# Altium schematic sheet PWR_MGMT.SchDoc
size D; SheetNumber: 2; SheetTotal: 4
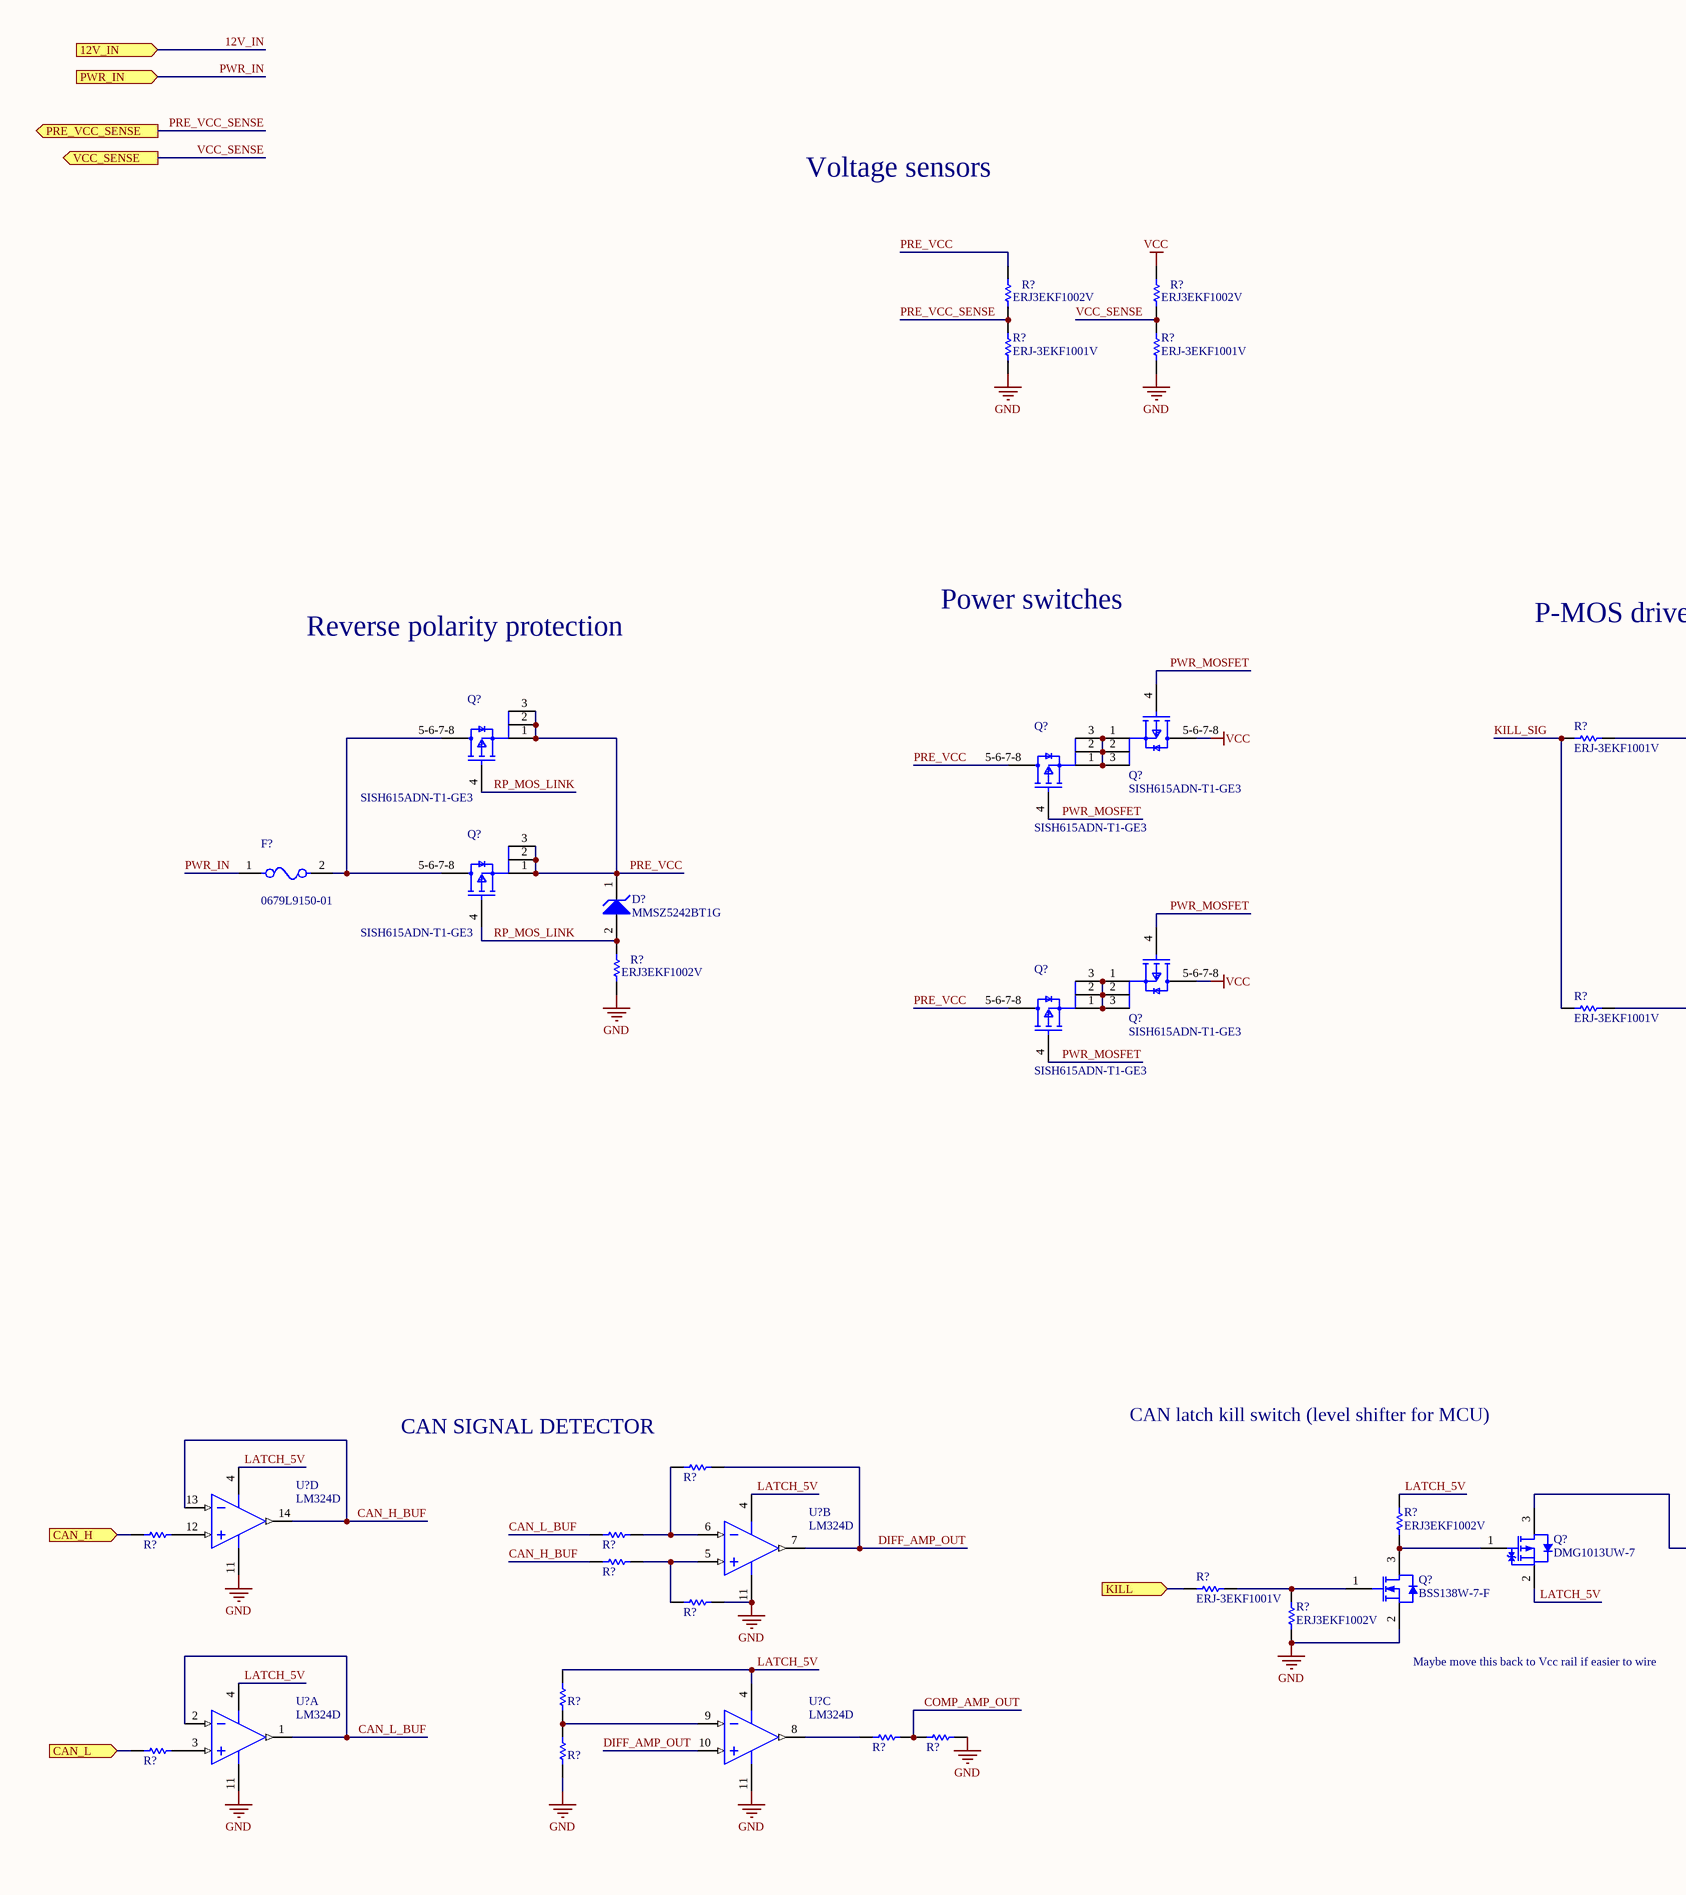
[diagram p0: PWR_MGMT.SchDoc, left]
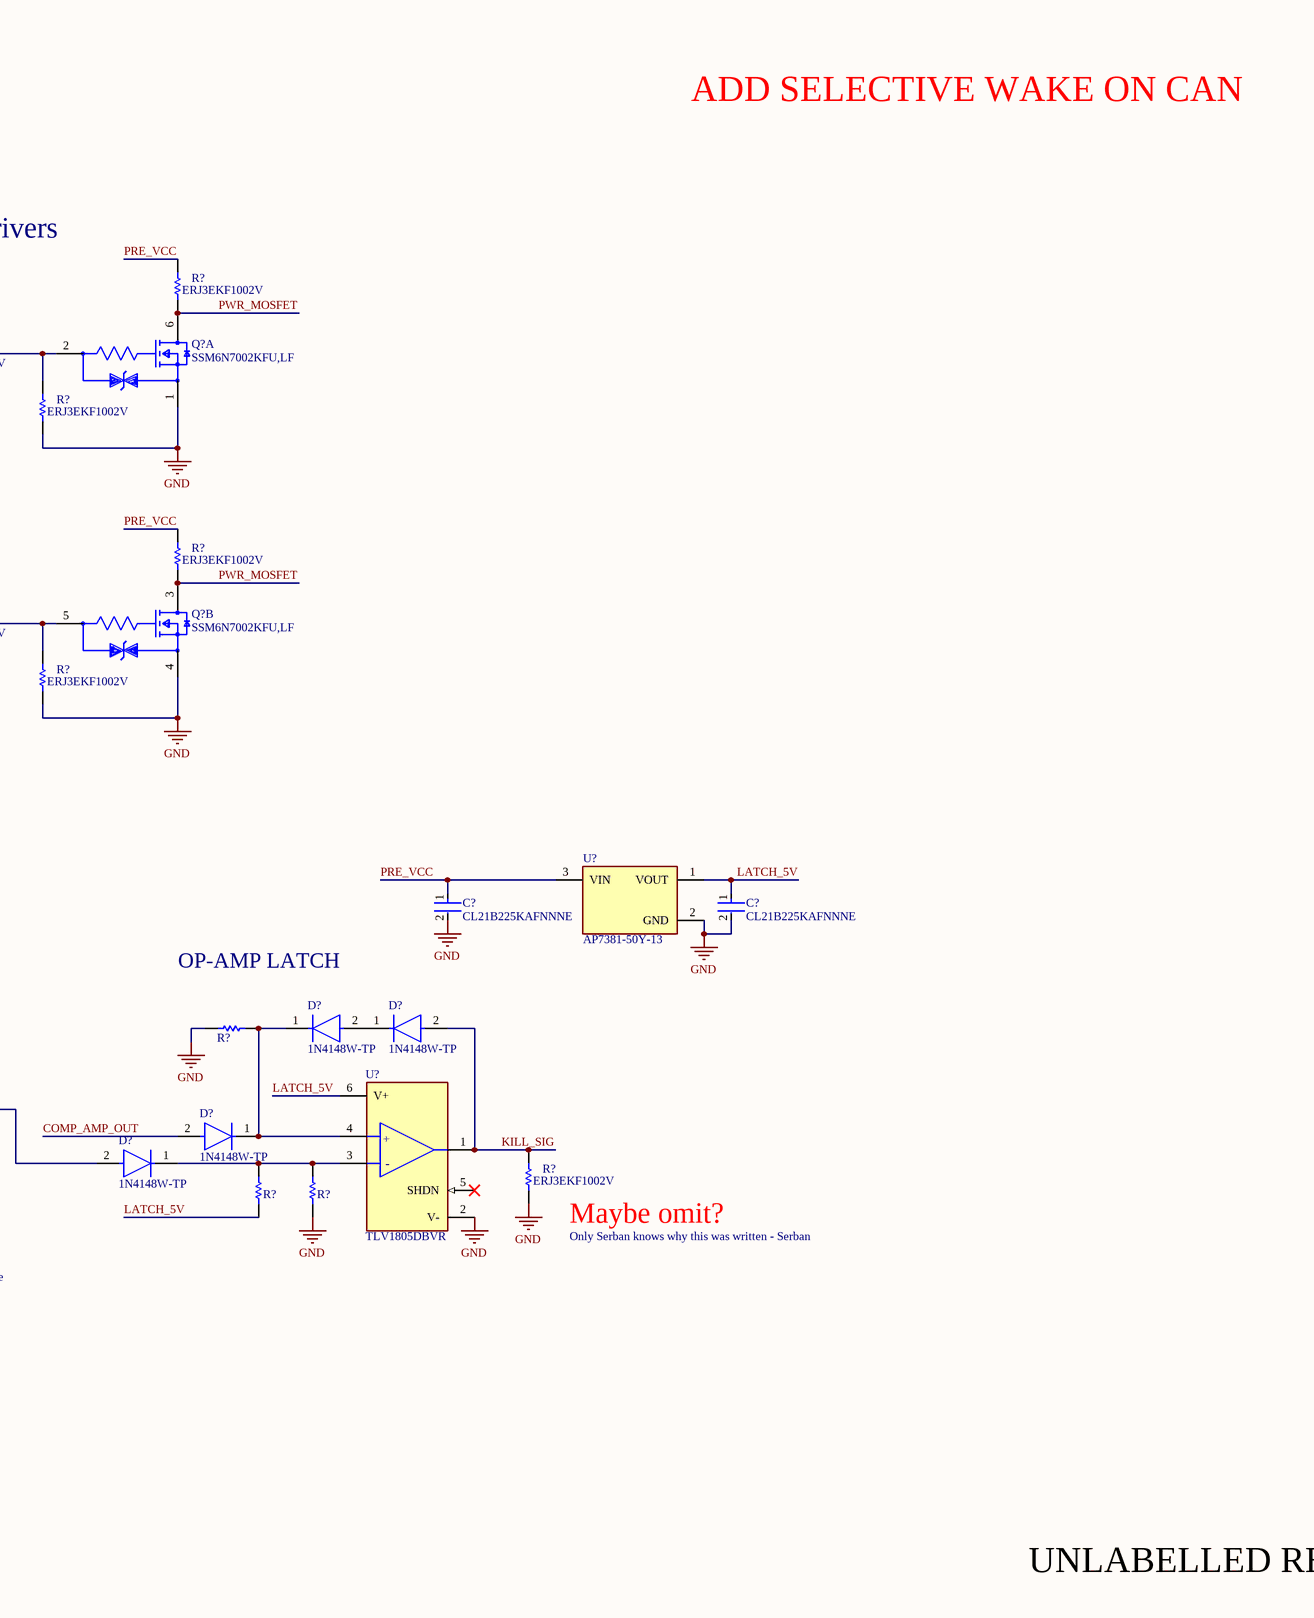
[diagram p1: PWR_MGMT.SchDoc, right]

## Parts
(Parts that share a designator on the sheet are numbered #1, #2 ... from top to bottom, then left to right.)
C?#1  CL21B225KAFNNNE  [FP-0805-L_2_01_0_2-W_1_25-IPC_B]
C?#2  CL21B225KAFNNNE  [FP-0805-L_2_01_0_2-W_1_25-IPC_B]
D?#1  MMSZ5242BT1G  [ONSC-SOD-123-2-425-04_V]
D?#2  1N4148W-TP  [FP-SOD-123-IPC_A]
D?#3  1N4148W-TP  [FP-SOD-123-IPC_A]
D?#4  1N4148W-TP  [FP-SOD-123-IPC_A]
D?#5  1N4148W-TP  [FP-SOD-123-IPC_A]
F?  0679L9150-01  [FP-0679L-MFG]
Q?#1  SISH615ADN-T1-GE3  [SISH615ADN-T1-GE3-Footprint-1]
Q?#2  SSM6N7002KFU,LF  [FP-SSOP6-P-0_65A-MFG]  (part A of 2)
Q?#3  SISH615ADN-T1-GE3  [SISH615ADN-T1-GE3-Footprint-1]
Q?#4  SISH615ADN-T1-GE3  [SISH615ADN-T1-GE3-Footprint-1]
Q?#5  SISH615ADN-T1-GE3  [SISH615ADN-T1-GE3-Footprint-1]
Q?#6  SISH615ADN-T1-GE3  [SISH615ADN-T1-GE3-Footprint-1]
Q?#7  SSM6N7002KFU,LF  [FP-SSOP6-P-0_65A-MFG]  (part B of 2)
Q?#8  SISH615ADN-T1-GE3  [SISH615ADN-T1-GE3-Footprint-1]
Q?#9  DMG1013UW-7  [DIOD-SOT323-3_V]
Q?#10  BSS138W-7-F  [DIOD-SOT323-3_V]
R?#1  ERJ3EKF1002V  [RESC1609X55X30LL15T15]
R?#2  ERJ3EKF1002V  [RESC1609X55X30LL15T15]
R?#3  ERJ-3EKF1001V  [RESC1608X55X30LL15T15]
R?#4  ERJ-3EKF1001V  [RESC1608X55X30LL15T15]
R?#5  ERJ3EKF1002V  [RESC1609X55X30LL15T15]
R?#6  ERJ-3EKF1001V  [RESC1608X55X30LL15T15]
R?#7  ERJ3EKF1002V  [RESC1609X55X30LL15T15]
R?#8  ERJ3EKF1002V  [RESC1609X55X30LL15T15]
R?#9  ERJ3EKF1002V  [RESC1609X55X30LL15T15]
R?#10  ERJ-3EKF1001V  [RESC1608X55X30LL15T15]
R?#11  ERJ3EKF1002V  [RESC1609X55X30LL15T15]
R?#12  ERJ3EKF1002V  [RESC1609X55X30LL15T15]  (value not drawn)
R?#13  ERJ3EKF1002V  [RESC1609X55X30LL15T15]  (value not drawn)
R?#14  ERJ3EKF1002V  [RESC1609X55X30LL15T15]  (value not drawn)
R?#15  ERJ3EKF1002V  [RESC1609X55X30LL15T15]  (value not drawn)
R?#16  ERJ3EKF1002V  [RESC1609X55X30LL15T15]
R?#17  ERJ3EKF1002V  [RESC1609X55X30LL15T15]
R?#18  ERJ3EKF1002V  [RESC1609X55X30LL15T15]  (value not drawn)
R?#19  ERJ3EKF1002V  [RESC1609X55X30LL15T15]  (value not drawn)
R?#20  ERJ3EKF1002V  [RESC1609X55X30LL15T15]  (value not drawn)
R?#21  ERJ3EKF1002V  [RESC1609X55X30LL15T15]  (value not drawn)
R?#22  ERJ-3EKF1001V  [RESC1608X55X30LL15T15]
R?#23  ERJ3EKF1002V  [RESC1609X55X30LL15T15]
R?#24  ERJ3EKF1002V  [RESC1609X55X30LL15T15]  (value not drawn)
R?#25  ERJ3EKF1002V  [RESC1609X55X30LL15T15]  (value not drawn)
R?#26  ERJ3EKF1002V  [RESC1609X55X30LL15T15]  (value not drawn)
R?#27  ERJ3EKF1002V  [RESC1609X55X30LL15T15]  (value not drawn)
R?#28  ERJ-3EKF1001V  [RESC1608X55X30LL15T15]  (value not drawn)
U?#1  AP7381-50Y-13  [FP-SOT89-MFG]
U?#2  TLV1805DBVR  [FP-DBV0006A-IPC_C]
U?#3  LM324D  [D0014A_L]  (part D of 4)
U?#4  LM324D  [D0014A_L]  (part B of 4)
U?#5  LM324D  [D0014A_L]  (part A of 4)
U?#6  LM324D  [D0014A_L]  (part C of 4)

## Ports
12V_IN (in), CAN_H (in), CAN_L (in), KILL (in), PRE_VCC_SENSE (out), PWR_IN (in), VCC_SENSE (out)

## Nets
GND: C?#1.2 C?#2.2 Q?#2.1(Source1) Q?#7.4(Source2) Q?#10.2(S) R?#3.1 R?#4.1 R?#7.2 R?#9.2 R?#11.2 R?#12.2 R?#17.2 R?#20.1 R?#21.2 R?#23.1 R?#26.1 R?#28.1 U?#1.2(GND) U?#2.2(V-) U?#3.11(GND) U?#4.11(GND) U?#5.11(GND) U?#6.11(GND)
VCC: Q?#1.5-6-7-8(D) Q?#6.5-6-7-8(D) R?#2.1
12V_IN: port 12V_IN
CAN_H: R?#14.1 ; port CAN_H
CAN_H_BUF: R?#18.1 U?#3.13(4IN-) U?#3.14(4OUT)
CAN_L: R?#27.1 ; port CAN_L
CAN_L_BUF: R?#15.1 U?#5.1(1OUT) U?#5.2(1IN-)
COMP_AMP_OUT: D?#4.2(A) R?#25.1 R?#26.2
DIFF_AMP_OUT: R?#13.2 U?#4.7(2OUT) U?#6.10(3IN+)
KILL: R?#22.2 ; port KILL
KILL_SIG: D?#3.2(A) R?#6.1 R?#10.1 R?#17.1 U?#2.1(OUT)
LATCH_5V: C?#2.1 Q?#9.2(S) R?#16.2 R?#19.1 R?#24.2 U?#1.1(VOUT) U?#2.6(V+) U?#3.4(VCC) U?#4.4(VCC) U?#5.4(VCC) U?#6.4(VCC)
PRE_VCC: C?#1.1 D?#1.1(K) Q?#3.1(S) Q?#3.2(S) Q?#3.3(S) Q?#4.5-6-7-8(D) Q?#5.1(S) Q?#5.2(S) Q?#5.3(S) Q?#8.5-6-7-8(D) R?#1.1 R?#5.1 R?#8.1 U?#1.3(VIN)
PRE_VCC_SENSE: R?#1.2 R?#3.2 ; port PRE_VCC_SENSE
PWR_IN: F?.1 ; port PWR_IN
PWR_MOSFET: Q?#1.4(G) Q?#2.6(Drain1) Q?#4.4(G) Q?#6.4(G) Q?#7.3(Drain2) Q?#8.4(G) R?#5.2 R?#8.2
RP_MOS_LINK: D?#1.2(A) Q?#3.4(G) Q?#5.4(G) R?#9.1
VCC_SENSE: R?#2.2 R?#4.2 ; port VCC_SENSE
NetD?#2_1: D?#2.1(C) D?#4.1(C) R?#12.1 U?#2.4(+IN)
NetD?#2_2: D?#2.2(A) D?#3.1(C)
NetD?#5_1: D?#5.1(C) R?#19.2 R?#20.2 U?#2.3(-IN)
NetD?#5_2: D?#5.2(A) Q?#9.3(D)
NetF?_2: F?.2 Q?#3.5-6-7-8(D) Q?#5.5-6-7-8(D)
NetQ?#1_1: Q?#1.1(S) Q?#1.2(S) Q?#1.3(S) Q?#4.1(S) Q?#4.2(S) Q?#4.3(S)
NetQ?#2_2: Q?#2.2(Gate1) R?#6.2 R?#7.1
NetQ?#6_1: Q?#6.1(S) Q?#6.2(S) Q?#6.3(S) Q?#8.1(S) Q?#8.2(S) Q?#8.3(S)
NetQ?#7_5: Q?#7.5(Gate2) R?#10.2 R?#11.1
NetQ?#9_1: Q?#9.1(G) Q?#10.3(D) R?#16.1
NetQ?#10_1: Q?#10.1(G) R?#22.1 R?#23.2
NetR?#13_1: R?#13.1 R?#15.2 U?#4.6(2IN-)
NetR?#14_2: R?#14.2 U?#3.12(4IN+)
NetR?#18_2: R?#18.2 R?#21.1 U?#4.5(2IN+)
NetR?#24_1: R?#24.1 R?#28.2 U?#6.9(3IN-)
NetR?#25_2: R?#25.2 U?#6.8(3OUT)
NetR?#27_2: R?#27.2 U?#5.3(1IN+)

Not connected (* = marked no-connect by the designer): U?#2 5(SHDN)*

## Notes on the sheet
- Voltage sensors
- ADD SELECTIVE WAKE ON CAN
- Power switches
- P-MOS drivers
- Reverse polarity protection
- OP-AMP LATCH
- CAN SIGNAL DETECTOR
- CAN latch kill switch (level shifter for MCU)
- (near R?#17) Maybe omit?
- Only Serban knows why this was written - Serban
- Maybe move this back to Vcc rail if easier to wire
- UNLABELLED RESISTORS ARE 10K
- (in symbol CMP-04896-000098-1) +; -

## Library data of the parts
C?#1 C?#2 = CMP-2007-04514-2: Voltage Rating (DC): 25V; Tolerance: 10%; Capacitance: 2.2uF; Dielectric: X7R; RoHS Compliant: Yes; Lead Free: Lead Free; Packaging: Tape and Reel; Case Code (Imperial): 0805; Case/Package: 0805; Contact Plating: Tin; Mount: Surface Mount; Construction: Flat; Voltage: 25V; REACH SVHC: No SVHC; Thickness: 0.06inch; Depth: 1.25mm; Max Operating Temperature: 125°C; Package Quantity: 3000; Width: 0.049inch; Height: 1.52mm; Case Code (Metric): 2012; Number of Pins: 2; Termination: SMD/SMT; Voltage Rating: 25V; Radiation Hardening: No; Series: FlEXITERM; Length: 2.01mm; Min Operating Temperature: -55°C
D?#1 = CMP-1060-00565-1: Zener Voltage Regulator, 500 mW, 2-Pin SOD-123, Pb-Free, Tape and Reel; Manufacturer: On Semiconductor; P Max (W): 0.5; VZ Typ (V): 12; PartNumber: MMSZ5242BT1G; PackageReference: SOD-123-2-425-04; ComponentLink3URL: http://www.onsemi.com/pub_link/Collateral/425-04.PDF; Mounting Technology: Surface Mount; ComponentLink2Description: Datasheet; ComponentLink1URL: http://www.onsemi.com/; ComponentLink3Description: Package Specification; PackageDescription: 2-Pin SOD, Body 1.6 x 2.69 mm; PackageVersion: Rev. G, 10/2009; ComponentLink1Description: Manufacturer URL; RoHS: Pb-Free; ComponentLink2URL: http://www.onsemi.com/pub_link/Collateral/MMSZ5221BT1-D.PDF; Packing: Tape and Reel; DatasheetVersion: Rev. 12
D?#2-D?#5 = CMP-2000-04993-2: DIODE GEN PURP 100V 150MA SOD123; Max Reverse Leakage Current: 5uA; Max Surge Current: 2A; Reverse Recovery Time: 4ns; Polarity: Standard; Capacitance: 4pF; Max Forward Surge Current (Ifsm): 1A; Element Configuration: Single; Power Dissipation: 400mW; Forward Voltage: 1V; Radiation Hardening: No; Lead Free: Lead Free; Max Reverse Voltage (DC): 100V; Current Rating: 150mA; Forward Current: 150mA; Packaging: Tape and Reel; Number of Pins: 2; Package Quantity: 3000; Max Operating Temperature: 150°C; Min Operating Temperature: -65°C; Average Rectified Current: 150mA; Recovery Time: 4ns; Output Current: 150mA; Peak Non-Repetitive Surge Current: 2A; Width: 1.8mm; Voltage Rating (DC): 100V; Height: 1.2mm; Max Repetitive Reverse Voltage (Vrrm): 100V; Mount: Surface Mount; Length: 2.85mm
F? = CMP-16042-000002-1: FUSE BRD MNT 15A 125VAC/VDC; Manufacturer: Bel Fuse; Max Fuse Ac Voltage: 125V; Fuse Blow Speed: Fast; Fuse I2T: 103.5A2Sec; Fuse Interrupt Ac Current: 50A; Automotive Grade: Grade 1; Value: 0.0038Ω; Fuse Interrupt Dc Current: 300A; Fuse Voltage Drop: 0.13V; Device Class L2: Fuses; ComponentLink2URL: https://www.belfuse.com/resources/CircuitProtection/datasheets/0679L%20Sep2016.pdf; Package: 0679L; Height: 2.79mm; Digikey Description: FUSE BRD MNT 15A 125VAC/VDC; Temperature Range High: +125°C; Device Class L3: unset; Octopart: https://octopart.com/0679l9150-01-bel+fuse-70850665; Temperature Range Low: -55°C; Fuse Current: 15A; Max Fuse Dc Voltage: 125V; Ipc Land Pattern Name: CAPC610254X254; Manufacturer Part Number: 0679L9150-01; Category: Fuse; Lead Free: Yes; Automotive: Yes; Resistance: 0.0038Ω; RoHS: TRUE; Device Class L1: Circuit Protection; ComponentLink2Description: Datasheet; Temperature: -55°C to +125°C; Voltage Rating: 125V
Q?#1 Q?#3-Q?#6 Q?#8 = CMP-013-00036-2: Trans MOSFET P-CH 20V 22.1A 8-Pin PowerPAK 1212 EP T/R
Q?#2 Q?#7 = CMP-35916-000009-1: MOSFET 2N-CH 60V 0.3A; Input Capacitance: 40pF; Continuous Drain Current (ID): 300mA; Max Power Dissipation: 285mW; FET Type: 2 N-Channel; Rds On Max: 1.5R; Mount: Surface Mount; Drain to Source Voltage (Vdss): 60V; Packaging: Tape and Reel
Q?#9 = CMP-2000-06170-1: P-Channel Enhancement Mode MOSFET, 310 mW, 20 V, -55 to 150 degC, 3-Pin SOT-323, RoHS, Tape and Reel; Manufacturer: Diodes Inc; Qg Gate Charge: 0.622nC; Drain-Source On Resistance-Max: 750mO; Rated Power Dissipation: 310mW; Drain-to-Source Voltage [Vdss]: 20V; Package Reference: SOT323; Datasheet Version: Rev. 3-2, 09/2013; Package Description: 3-Pin Small Outline Transistor, Body 2 x 1.25 mm, Pitch 0.65 mm; Mounting Technology: SurfaceMount; Manufacturer URL: http://www.diodes.com/; Datasheet URL: http://www.diodes.com/_files/datasheets/ds31861.pdf; Channel Type: P-Channel
Q?#10 = CMP-2000-05968-1: N-Channel Enhancement Mode Mosfet, 50 V, 200 mA, -55 to 150 degC, 6-Pin SOT-323, RoHS, Tape and Reel; Typical Turn-Off Delay Time: 20ns; Number of Channels: 1Channel; Type: EnhancementModeFieldEffectTransistor; Brand: DiodesIncorporated; Vds - Drain-Source Breakdown Voltage: 75V; Vgs - Gate-Source Voltage: 20V; Rds On - Drain-Source Resistance: 1.4Ohms; Transistor Type: 1N-Channel; Configuration: Single; Unit Weight: 0.000212oz; Pd - Power Dissipation: 200mW; Id - Continuous Drain Current: 200mA; Forward Transconductance - Min: 0.1S; Manufacturer URL: http://www.diodes.com/; Series: BSS138; Package Description: 3-Pin Small Outline Transistor, Body 2 x 1.25 mm, Pitch 0.65 mm; Mounting Technology: SurfaceMount; Product Category: MOSFET; RoHS: True; Maximum Operating Temperature: +150C; Height: 1mm; Length: 2.2mm; Technology: Si; Width: 1.35mm; Datasheet URL: http://www.diodes.com/_files/datasheets/ds30206.pdf; Manufacturer: DiodesIncorporated; Package / Case: SOT-323-3; Typical Turn-On Delay Time: 20ns; Transistor Polarity: N-Channel; Factory Pack Quantity: 3000; Packaging: Reel; Product: MOSFETSmallSignal; Datasheet Version: Rev. 11-2, 09/2013; Package Reference: SOT323; Minimum Operating Temperature: -55C; Mounting Style: SMD/SMT; Channel Mode: Enhancement
R?#1 R?#2 R?#5 R?#7-R?#9 R?#11-R?#21 R?#23-R?#27 = CMP-1012-00623-3: Chip Resistor, 10 KOhm, +/- 1%, 0.1 W, -55 to 155 degC, 0603 (1608 Metric), RoHS, Tape and Reel; Manufacturer: Panasonic; Voltage Rating: 75V; Case\/Package: 0603; Power Rating: 100mW; Resistance: 10KOhm; Temperature Coefficient: 100ppm\/degreesC; Number of Pins: 2; Package Reference: 603; Depth: 0.8mm; Mount: SurfaceMount; Package Description: 2-Pin Surface Mount Device, Body 1.6 x 0.85 mm; Datasheet Version: 02/2017; Length: 1.6mm; Lead Free: LeadFree; Height: 0.45mm; Number of Terminations: 2; Max Power Dissipation: 100mW; Min Operating Temperature: -55degC; Datasheet URL: https://industrial.panasonic.com/cdbs/www-data/pdf/RDA0000/AOA0000C304.pdf; Termination: SMD/SMT; Case Code (Metric): 1608; Case Code (Imperial): 0603; Tolerance: 1%; Max Operating Temperature: 155degC; RoHSCompliant: true; Voltage Rating (DC): 75V; Radiation Hardening: No; Packaging: TapeandReel; Composition: ThickFilm; Mounting Technology: SurfaceMount; Manufacturer URL: http://www.panasonic.com/; Width: 0.031inch; REACH SVHC: NoSVHC; Contact Plating: Tin; Military Standard: Not; Package Quantity: 1
R?#3 R?#4 R?#6 R?#10 R?#22 R?#28 = CMP-2000-00180-1: Manufacturer: Panasonic; Part Number: ERJ-3EKF1001V
U?#1 = CMP-12756-000009-1: IC REG LINEAR 5V 150MA SOT89; Manufacturer: Diodes Inc.; Output Type: Fixed; Min Supply Voltage: 3.3V; Max Junction Temp: +125°C; Max Supply Voltage: 40V; Nominal Supply Current: 2.5-25uA; Number Of Outputs: 1; Dropout Voltage: 1000mV; Manufacturer Part Number: AP7381-50Y-13; RoHS: TRUE; Digikey Description: IC REG LINEAR 5V 150MA SOT89; Output Voltage: 5V; Footprint Url: https://www.diodes.com/assets/Package-Files/SOT89.pdf; Category: IC; Temperature: -40°C to +125°C; ComponentLink2Description: Datasheet; Package: SOT89; Temperature Range Low: -40°C; Temperature Range High: +125°C; ComponentLink2URL: https://www.diodes.com/assets/Datasheets/AP7381.pdf; Device Class L1: Integrated Circuits (ICs); Automotive: No; Output Current: 150mA; Ambient Temperature Range High: +85°C; Octopart: https://octopart.com/ap7381-50y-13-diodes+inc.-87775116; Lead Free: Yes; Device Class L2: Power Management ICs; Height: 1.6mm; Device Class L3: Voltage Regulators - Linear; Ambient Temperature Range Low: -40°C
U?#2 = CMP-04896-000098-1: 40V, RAIL-TO-RAIL INPUT, PUSH-PU
U?#3-U?#6 = CMP-2000-06547-1: Quadruple Operational Amplifier, 0.5 V/us, 1.2 MHz, 3 to 32 V, 0 to 70 degC, 14-Pin SOIC (D), Green (RoHS & no Sb/Br), Tube; Manufacturer: Texas Instruments; Unity Gain Bandwidth Product: 1.2MHz; Input Offset Voltage: 7mV; Dual Supply Voltage (Max): ±16V; Single Supply Voltage (Min): 3V; Single Supply Voltage (Max): 32V; Voltage Gain in dB: 100dB; Power Supply Requirement: Single/Dual; Input Bias Current: 250nA; Dual Supply Voltage (Min): ±1.5V; Single Supply Voltage (Typ): 5/9/12/15/18/24/28V; Dual Supply Voltage (Typ): ±3/±5/±9/±12/±15V; Number of  Elements: 4; Common Mode Rejection Ratio: 65dB; Datasheet Version: Rev. W, 03/2015; Technology: Bipolar; Shut Down Feature: No; Package Reference: D0014A; Type: GeneralPurposeAmplifier; Pin Count: 14; Package Type: SOIC; Rail/Rail I/O Type: No; Manufacturer URL: http://www.ti.com/; Package Description: 14-Pin Small Outline Integrated Circuit, Body 8.65 x 3.9 mm, Pitch 1.27 mm; Operating Temperature Classification: Commercial; Datasheet URL: http://www.ti.com/lit/ds/symlink/lm324.pdf; Slew Rate: 0.5V/us; Package URL: http://www.ti.com/lit/ml/mpds177g/mpds177g.pdf; Mounting: SurfaceMount; Packaging: Rail/Tube; Mounting Technology: SurfaceMount; Operating Temp Range: 0Cto70C